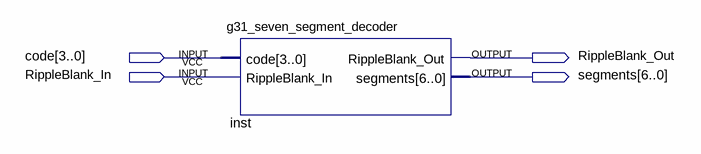
[diagram p0: schematic sheet]
// Quartus schematic g31_seven_segment_decoder_circuit.bdf as structural Verilog: 1 symbols, 4 pins
module g31_seven_segment_decoder_circuit (
  input  [3:0] code,
  input  RippleBlank_In,
  output RippleBlank_Out,
  output [6:0] segments
);

  g31_seven_segment_decoder inst (
    .code(code), .RippleBlank_In(RippleBlank_In), .RippleBlank_Out(RippleBlank_Out), .segments(segments));
endmodule
